# EAGLE schematic Lab1_Schematics (EAGLE 9.6.2)
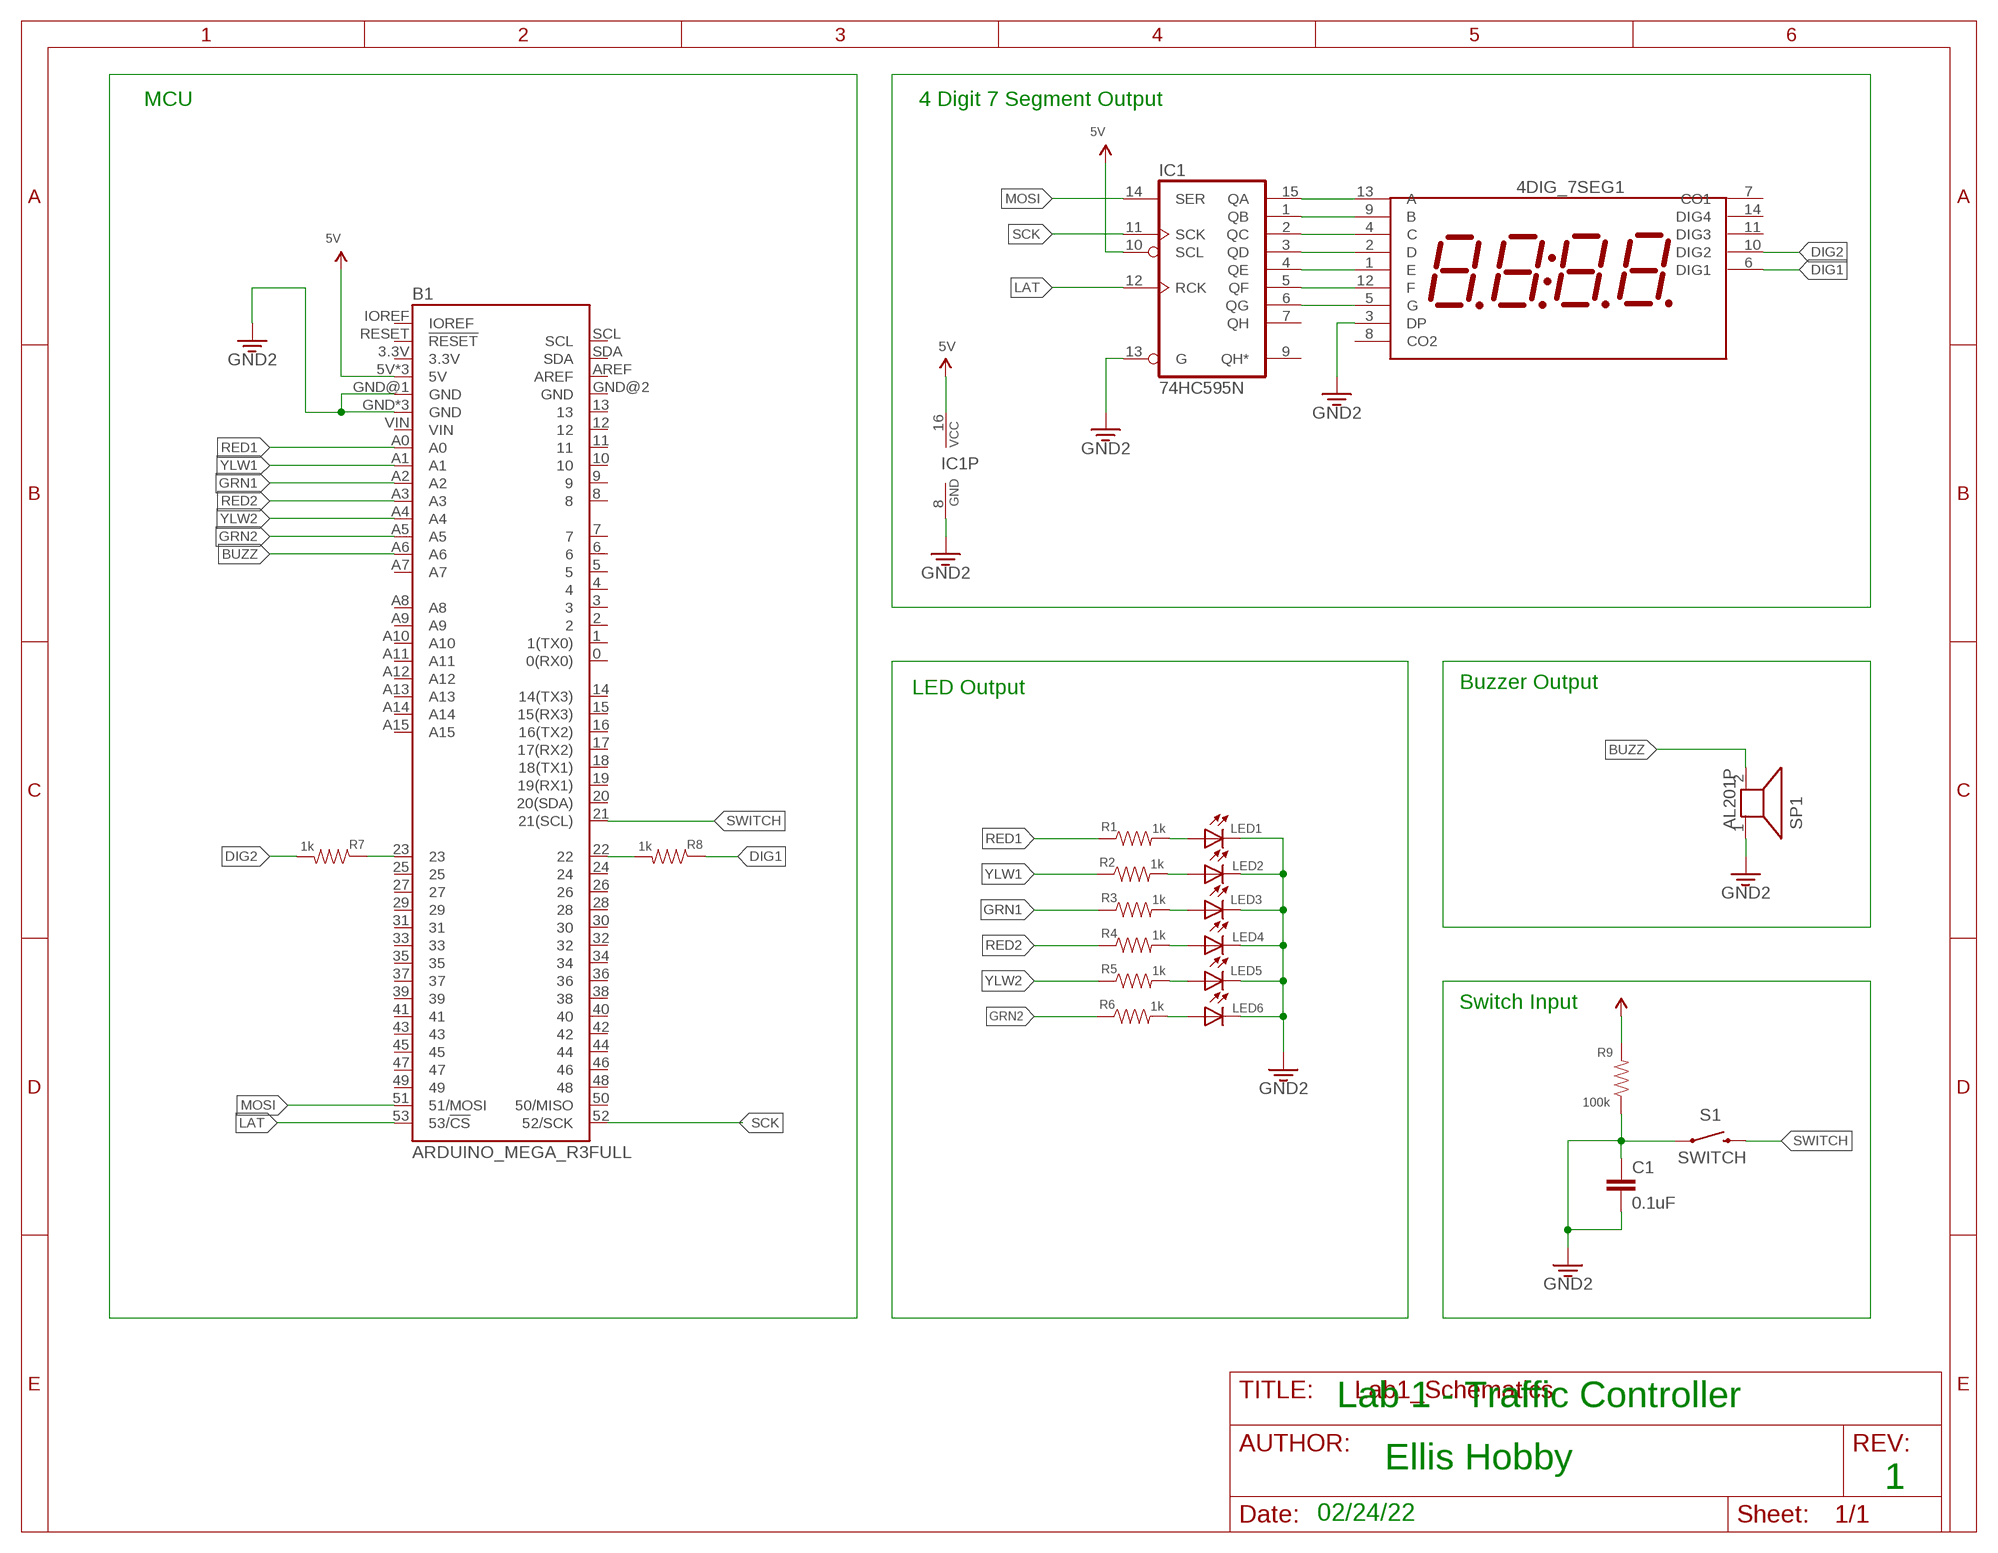
[diagram p0: schematic, sheet 1]

## Parts
4DIG_7SEG1  4DIG_7SEG  [4DIG_7SEG]
B1  ARDUINO_MEGA_R3FULL  [ARDUINO_MEGA_NO_SILK]
C1  0.1uF  0.1UF-KIT-EZ-50V-20%  [CAP-PTH-SMALL-KIT]
IC1  74HC595N  [DIL16]
LED1  LED5MM  [LED5MM]
LED2  LED5MM  [LED5MM]
LED3  LED5MM  [LED5MM]
LED4  LED5MM  [LED5MM]
LED5  LED5MM  [LED5MM]
LED6  LED5MM  [LED5MM]
R1  1k  1KOHM-HORIZ-1/4W-1%  [AXIAL-0.3]
R2  1k  1KOHM-HORIZ-1/4W-1%  [AXIAL-0.3]
R3  1k  1KOHM-HORIZ-1/4W-1%  [AXIAL-0.3]
R4  1k  1KOHM-HORIZ-1/4W-1%  [AXIAL-0.3]
R5  1k  1KOHM-HORIZ-1/4W-1%  [AXIAL-0.3]
R6  1k  1KOHM-HORIZ-1/4W-1%  [AXIAL-0.3]
R7  1k  1KOHM-HORIZ-1/4W-1%  [AXIAL-0.3]
R8  1k  1KOHM-HORIZ-1/4W-1%  [AXIAL-0.3]
R9  100k  1KOHM-HORIZ-1/4W-1%  [AXIAL-0.3]
S1  SWITCH  MOMENTARY-SWITCH-SPST-PTH-6.0MM  [TACTILE_SWITCH_PTH_6.0MM]
SP1  AL201P  [AL201P]

## Nets
3.3V: 4DIG_7SEG1.3(DP) B1.GND B1.GND@1(GND) B1.GND@3(GND) B1.GND@4(GND) C1.1 C1.2 IC1.8(GND) IC1.13(G) LED1.K(C) LED2.K(C) LED3.K(C) LED4.K(C) LED5.K(C) LED6.K(C) R9.P$1 S1.1 SP1.1 ; supply symbol labelled GND2
5V: B1.5V B1.5V@1(5V) B1.5V@2(5V) IC1.10(SCL) IC1.16(VCC) R9.P$2
BUZZ: B1.A6 SP1.2
DIG1: 4DIG_7SEG1.6(DIG1) R8.P$1
DIG2: 4DIG_7SEG1.10(DIG2) R7.P$2
GRN1: B1.A2 R3.P$1
GRN2: B1.A5 R6.P$1
LAT: B1.53(53/!CS) IC1.12(RCK)
MOSI: B1.51(51/MOSI) IC1.14(SER)
N$7: LED1.A R1.P$2
N$8: LED2.A R2.P$2
N$9: LED3.A R3.P$2
N$10: LED4.A R4.P$2
N$11: LED5.A R5.P$2
N$12: LED6.A R6.P$2
N$14: 4DIG_7SEG1.13(A) IC1.15(QA)
N$15: 4DIG_7SEG1.9(B) IC1.1(QB)
N$17: 4DIG_7SEG1.4(C) IC1.2(QC)
N$18: 4DIG_7SEG1.2(D) IC1.3(QD)
N$19: 4DIG_7SEG1.1(E) IC1.4(QE)
N$20: 4DIG_7SEG1.12(F) IC1.5(QF)
N$21: 4DIG_7SEG1.5(G) IC1.6(QG)
N$23: B1.23 R7.P$1
N$24: B1.22 R8.P$2
RED1: B1.A0 R1.P$1
RED2: B1.A3 R4.P$1
SCK: B1.52(52/SCK) IC1.11(SCK)
SWITCH: B1.21(21(SCL)) S1.3
YLW1: B1.A1 R2.P$1
YLW2: B1.A4 R5.P$1
Unconnected: 4DIG_7SEG1.7(CO1) 4DIG_7SEG1.8(CO2) 4DIG_7SEG1.11(DIG3) 4DIG_7SEG1.14(DIG4) B1.0(0(RX0)) B1.1(1(TX0)) B1.2 B1.3 B1.3.3V B1.4 B1.5 B1.6 B1.7 B1.8 B1.9 B1.10 B1.11 B1.12 B1.13 B1.14(14(TX3)) B1.15(15(RX3)) B1.16(16(TX2)) B1.17(17(RX2)) B1.18(18(TX1)) B1.19(19(RX1)) B1.20(20(SDA)) B1.24 B1.25 B1.26 B1.27 B1.28 B1.29 B1.30 B1.31 B1.32 B1.33 B1.34 B1.35 B1.36 B1.37 B1.38 B1.39 B1.40 B1.41 B1.42 B1.43 B1.44 B1.45 B1.46 B1.47 B1.48 B1.49 B1.50(50/MISO) B1.A7 B1.A8 B1.A9 B1.A10 B1.A11 B1.A12 B1.A13 B1.A14 B1.A15 B1.AREF B1.GND@2(GND) B1.IOREF B1.RESET(!RESET) B1.SCL B1.SDA B1.VIN IC1.7(QH) IC1.9(QH*)

## Notes on the sheet
- MCU | 4 Digit 7 Segment Output
- LED Output | Buzzer Output
- Switch Input
- Lab 1 - Traffic Controller
- Ellis Hobby
- 1
- 02/24/22

## Library data of the parts
4DIG_7SEG1 = 7-seg-disp:4DIG_7SEG: This library is modified to the Adafruit 4dig7seg display, part# KW4-56NCBA-P. It doesn't have the up decimal, and the pins are reassigned. This is common cathode. This library was based on BL-Q39A42 respectively BL-Q39B42 display but support many others displays where PAD/PIN assign is same.Display may be common cathode or common anode because PAD/PIN assign is still the same. PIN DESCRIPTION: DIG1-DIG4 : common cathode or common anode of digit CO1-CO2: cathode or anode of colon (Depends on the display), DIG1-DIG4: common cathodes or anodes of digits, A - G+ DP: cathodes or anodes of segments A to F with dot point . Made by: www.developrog.com, modified by Kiki Jewell 2016
B1 = SparkFun-Boards:ARDUINO_MEGA_R3: Arduino Mega R3 ATmega2560 R3 compatible footprint. SparkFun Products: Arduino Mega 2560 R3 <https://www.sparkfun.com/products/11061>
C1 = SparkFun-Capacitors:0.1UF: 0.1µF ceramic capacitors A capacitor is a passive two-terminal electrical component used to store electrical energy temporarily in an electric field.; PROD_ID: CAP-08370
IC1 = 74xx-eu:74*595: 8-bit SHIFT REGISTER, output latch
LED1-LED6 = adafruit:LED: LED OSRAM: - CHIPLED LG R971, LG N971, LY N971, LG Q971, LY Q971, LO R971, LY R971 LH N974, LH R974 LS Q976, LO Q976, LY Q976 LO Q996 - Hyper CHIPLED LW Q18S LB Q993, LB Q99A, LB R99A - SideLED LS A670, LO A670, LY A670, LG A670, LP A670 LB A673, LV A673, LT A673, LW A673 LH A674 LY A675 LS A676, LA A676, LO A676, LY A676, LW A676 LS A679, LY A679, LG A679 - Hyper Micro SIDELED® LS Y876, LA Y876, LO Y876, LY Y876 LT Y87S - SmartLED LW L88C, LW L88S LB L89C, LB L89S, LG L890 LS L89K, LO L89K, LY L89K LS L896, LA L896, LO L896, LY L896 - TOPLED LS T670, LO T670, LY T670, LG T670, LP T670 LSG T670, LSP T670, LSY T670, LOP T670, LYG T670 LG T671, LOG T671, LSG T671 LB T673, LV T673, LT T673, LW T673 LH T674 LS T676, LA T676, LO T676, LY T676, LB T676, LH T676, LSB T676, LW T676 LB T67C, LV T67C, LT T67C, LS T67K, LO T67K, LY T67K, LW E67C LS E67B, LA E67B, LO E67B, LY E67B, LB E67C, LV E67C, LT E67C LW T67C LS T679, LY T679, LG T679 LS T770, LO T770, LY T770, LG T770, LP T770 LB T773, LV T773, LT T773, LW T773 LH T774 LS E675, LA E675, LY E675, LS T675 LS T776, LA T776, LO T776, LY T776, LB T776 LHGB T686 LT T68C, LB T68C - Hyper Mini TOPLED® LB M676 - Mini TOPLED Santana® LG M470 LS M47K, LO M47K, LY M47K Source: http://www.osram.convergy.de/
R1-R8 = SparkFun-Resistors:1KOHM: 1kΩ resistor A resistor is a passive two-terminal electrical component that implements electrical resistance as a circuit element. Resistors act to reduce current flow, and, at the same time, act to lower voltage levels within circuits. - Wikipedia; PROD_ID: RES-12182
R9 = SparkFun-Resistors:1KOHM: 1kΩ resistor A resistor is a passive two-terminal electrical component that implements electrical resistance as a circuit element. Resistors act to reduce current flow, and, at the same time, act to lower voltage levels within circuits. - Wikipedia; PROD_ID: RES-12182; VALUE: 1k
S1 = SparkFun-Switches:MOMENTARY-SWITCH-SPST: Momentary Switch (Pushbutton) - SPST Normally-open (NO) SPST momentary switches (buttons, pushbuttons). Variants PTH-12MM - 12mm square, through-hole Momentary Pushbutton Switch - 12mm Square <https://www.sparkfun.com/products/9190> (COM-09190) PTH-6.0MM, PTH-6.0MM-KIT - 6.0mm square, through-hole Mini Pushbutton Switch <https://www.sparkfun.com/products/97> (COM-00097) KIT package intended for soldering kit's - only one side of pads' copper is exposed. PTH-RIGHT-ANGLE-KIT - Right-angle, through-hole Right Angle Tactile Button <https://www.sparkfun.com/products/10791> - Used on SparkFun BigTime Watch Kit <https://www.sparkfun.com/products/11734> SMD-12MM - 12mm square, surface-mount Tactile Button - SMD (12mm) <https://www.sparkfun.com/products/12993> (COM-12993) Used on SparkFun PicoBoard <https://www.sparkfun.com/products/11888> SMD-4.5MM - 4.5mm Square Trackball Switch Used on SparkFun Blackberry Trackballer Breakout <https://www.sparkfun.com/products/13169> SMD-4.6MMX2.8MM - 4.60mm x 2.80mm, surface mount Used on SparkFun Pro Micro - RP2040 <https://www.sparkfun.com/products/17717> SMD-5.2MM, SMD-5.2-REDUNDANT - 5.2mm square, surface-mount Mini Pushbutton Switch - SMD <https://www.sparkfun.com/products/8720> (COM-08720) Used on Arduino Pro Mini <https://www.sparkfun.com/products/11114> REDUNDANT package connects both switch circuits together SMD-6.0X3.5MM - 6.0 x 3.5mm, surface mount Momentary Reset Switch SMD <https://www.sparkfun.com/products/8229> (COM-08229) SMD-6.2MM-TALL - 6.2mm square, surface mount Tactile Button - SMD (6mm) <https://www.sparkfun.com/products/12992> Used on SparkFun Digital Sandbox <https://www.sparkfun.com/products/12651> SMD-RIGHT-ANGLE - Right-angle, surface mount Used on SparkFun Block for Intel® Edison - Arduino <https://www.sparkfun.com/products/13036>; PROD_ID: SWCH-08441; SF_SKU: COM-00097
SP1 = buzzer:AL201P: SPEAKER Source: Buerklin; OC_FARNELL: unknown; OC_NEWARK: unknown